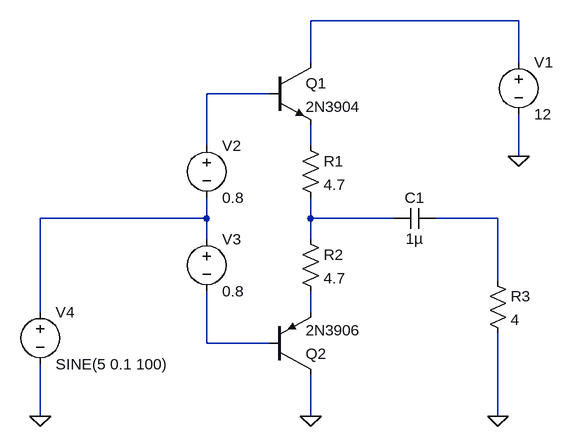
[diagram p0: schematic analysis_1.asc]
analysis_1.asc, the LTspice schematic file:
Version 4
SHEET 1 880 680
WIRE 512 16 192 16
WIRE 192 80 192 16
WIRE 512 80 512 16
WIRE 128 128 32 128
WIRE 32 208 32 128
WIRE 192 208 192 176
WIRE 512 224 512 160
WIRE 32 320 32 288
WIRE 32 320 -224 320
WIRE 192 320 192 288
WIRE 320 320 192 320
WIRE 480 320 384 320
WIRE 32 352 32 320
WIRE 192 352 192 320
WIRE 480 416 480 320
WIRE -224 464 -224 320
WIRE 192 464 192 432
WIRE 32 512 32 432
WIRE 128 512 32 512
WIRE -224 624 -224 544
WIRE 192 624 192 560
WIRE 480 624 480 496
FLAG 192 624 0
FLAG 512 224 0
FLAG -224 624 0
FLAG 480 624 0
SYMBOL npn 128 80 R0
SYMATTR InstName Q1
SYMATTR Value 2N3904
SYMBOL pnp 128 560 M180
SYMATTR InstName Q2
SYMATTR Value 2N3906
SYMBOL res 176 192 R0
SYMATTR InstName R1
SYMATTR Value 4.7
SYMBOL res 176 336 R0
SYMATTR InstName R2
SYMATTR Value 4.7
SYMBOL voltage 512 64 R0
WINDOW 123 0 0 Left 0
WINDOW 39 0 0 Left 0
SYMATTR InstName V1
SYMATTR Value 12
SYMBOL cap 384 304 R90
WINDOW 0 0 32 VBottom 2
WINDOW 3 32 32 VTop 2
SYMATTR InstName C1
SYMATTR Value 1µ
SYMBOL voltage 32 192 R0
WINDOW 123 0 0 Left 0
WINDOW 39 0 0 Left 0
SYMATTR InstName V2
SYMATTR Value 0.8
SYMBOL voltage 32 336 R0
WINDOW 123 0 0 Left 0
WINDOW 39 0 0 Left 0
SYMATTR InstName V3
SYMATTR Value 0.8
SYMBOL voltage -224 448 R0
WINDOW 123 0 0 Left 0
WINDOW 39 0 0 Left 0
SYMATTR InstName V4
SYMATTR Value SINE(5 0.1 100)
SYMBOL res 464 400 R0
SYMATTR InstName R3
SYMATTR Value 4

The netlist it stands for:
* analysis_1.asc
Q1 N001 N002 N003 0 2N3904
Q2 0 N008 N007 0 2N3906
R1 N003 N005 4.7
R2 N005 N007 4.7
V1 N001 0 12
C1 N006 N005 1µ
V2 N002 N004 0.8
V3 N004 N008 0.8
V4 N004 0 SINE(5 0.1 100)
R3 N006 0 4
.model NPN NPN
.model PNP PNP
.lib standard.bjt
.backanno
.end